# EAGLE schematic minime_2.1.1-a (EAGLE 7.5.0)
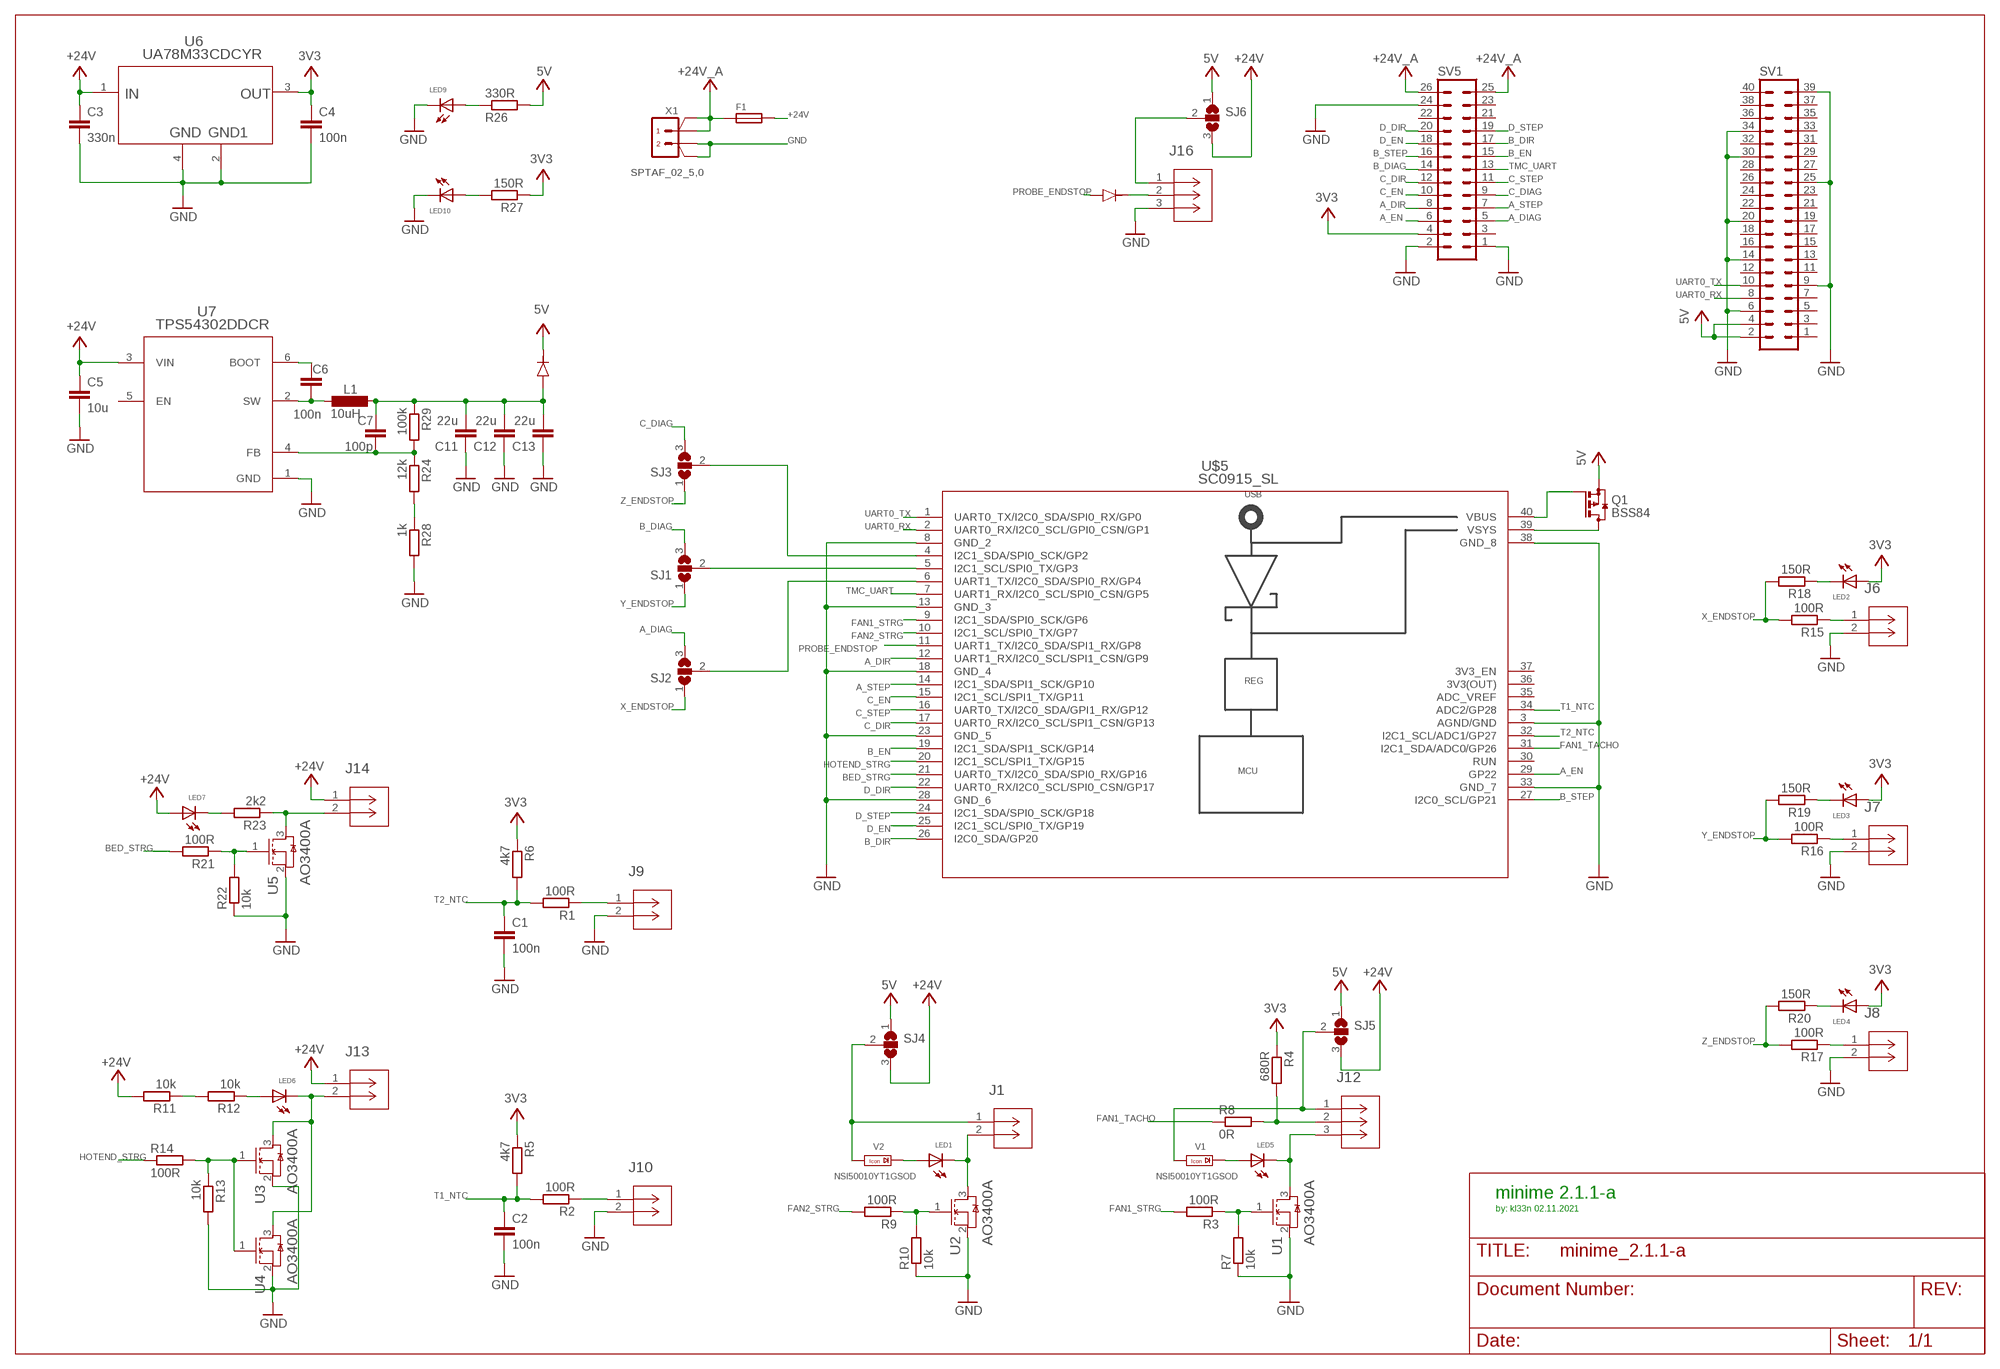
[diagram p0: schematic, sheet 1]

## Parts
C1  100n  C-EUC0603  [C0603]
C2  100n  C-EUC0603  [C0603]
C3  330n  C-EUC0603  [C0603]
C4  100n  C-EUC0603  [C0603]
C5  10u  C-EUC0603  [C0603]
C6  100n  C-EUC0603  [C0603]
C7  100p  C-EUC0603  [C0603]
C11  22u  C-EUC1210K  [C1210K]
C12  22u  C-EUC1210K  [C1210K]
C13  22u  C-EUC1210K  [C1210K]
CR1  SS54  SS14-E3/5AT  [DIODE_DO214AC]
CR2  SS14  SS14-E3/5AT  [DIODE_DO214AC]
F1  FUSE/SERIE154  [FUSE/NANO-OMNI]
J1  B2B-XH-A(LF)(SN)  [CONN_B2B-XH-A(LF)(SN)_JST]
J6  B2B-XH-A(LF)(SN)  [CONN_B2B-XH-A(LF)(SN)_JST]
J7  B2B-XH-A(LF)(SN)  [CONN_B2B-XH-A(LF)(SN)_JST]
J8  B2B-XH-A(LF)(SN)  [CONN_B2B-XH-A(LF)(SN)_JST]
J9  B2B-XH-A(LF)(SN)  [CONN_B2B-XH-A(LF)(SN)_JST]
J10  B2B-XH-A(LF)(SN)  [CONN_B2B-XH-A(LF)(SN)_JST]
J12  B3B-XH-A(LF)(SN)  [CONN_B3B-XH-A_JST]
J13  B2B-XH-A(LF)(SN)  [CONN_B2B-XH-A(LF)(SN)_JST]
J14  B2B-XH-A(LF)(SN)  [CONN_B2B-XH-A(LF)(SN)_JST]
J16  B3B-XH-A(LF)(SN)  [CONN_B3B-XH-A_JST]
L1  10uH  L-EUWE-TPC  [POWER-CHOKE_WE-TPC]
LED1  LEDCHIP-LED0603  [CHIP-LED0603]
LED2  LEDCHIP-LED0603  [CHIP-LED0603]
LED3  LEDCHIP-LED0603  [CHIP-LED0603]
LED4  LEDCHIP-LED0603  [CHIP-LED0603]
LED5  LEDCHIP-LED0603  [CHIP-LED0603]
LED6  LEDCHIP-LED0603  [CHIP-LED0603]
LED7  LEDCHIP-LED0603  [CHIP-LED0603]
LED9  LEDCHIP-LED0603  [CHIP-LED0603]
LED10  LEDCHIP-LED0603  [CHIP-LED0603]
Q1  BSS84  [SOT23]
R1  100R  R-EU_R0603  [R0603]
R2  100R  R-EU_R0603  [R0603]
R3  100R  R-EU_R0603  [R0603]
R4  680R  R-EU_R0603  [R0603]
R5  4k7  R-EU_R0603  [R0603]
R6  4k7  R-EU_R0603  [R0603]
R7  10k  R-EU_R0603  [R0603]
R8  0R  R-EU_R0603  [R0603]
R9  100R  R-EU_R0603  [R0603]
R10  10k  R-EU_R0603  [R0603]
R11  10k  R-EU_R0603  [R0603]
R12  10k  R-EU_R0603  [R0603]
R13  10k  R-EU_R0603  [R0603]
R14  100R  R-EU_R0603  [R0603]
R15  100R  R-EU_R0603  [R0603]
R16  100R  R-EU_R0603  [R0603]
R17  100R  R-EU_R0603  [R0603]
R18  150R  R-EU_R0603  [R0603]
R19  150R  R-EU_R0603  [R0603]
R20  150R  R-EU_R0603  [R0603]
R21  100R  R-EU_R0603  [R0603]
R22  10k  R-EU_R0603  [R0603]
R23  2k2  R-EU_R0603  [R0603]
R24  12k  R-EU_R0603  [R0603]
R26  330R  R-EU_R0603  [R0603]
R27  150R  R-EU_R0603  [R0603]
R28  1k  R-EU_R0603  [R0603]
R29  100k  R-EU_R0603  [R0603]
SJ1  SJ2W  [SJ_2]
SJ2  SJ2W  [SJ_2]
SJ3  SJ2W  [SJ_2]
SJ4  SJ2W  [SJ_2]
SJ5  SJ2W  [SJ_2]
SJ6  SJ2W  [SJ_2]
SV1  MA20-2  [MA20-2]
SV5  MA13-2  [MA13-2]
U1  AO3400A  [SOT-23-3L_AOS]
U2  AO3400A  [SOT-23-3L_AOS]
U3  AO3400A  [SOT-23-3L_AOS]
U4  AO3400A  [SOT-23-3L_AOS]
U5  AO3400A  [SOT-23-3L_AOS]
U6  UA78M33CDCYR  [DCY0004A_N]
U7  TPS54302DDCR  [DDC0006A_N]
U$5  SC0915_SL  [STIFTLEISTE]
V1  NSI50010YT1GSOD  [SOD123]
V2  NSI50010YT1GSOD  [SOD123]
X1  SPTAF_02_5,0  [5-2]

## Nets
3V3: C4.1 LED2.A LED3.A LED4.A R4.1 R5.1 R6.1 R27.1 SV5.4 U6.3(OUTPUT)
5V: CR1.1 Q1.2(S) R26.2 SJ4.1 SJ5.1 SJ6.1 SV1.2 SV1.4
+24V: C3.1 C5.1 F1.2 J13.1 J14.1 LED7.A R11.2 SJ4.3 SJ5.3 SJ6.3 U6.1(INPUT) U7.3(VIN)
+24V_A: F1.1 SV5.25 SV5.26 X1.1 X1.1A
A_DIAG: SJ2.3 SV5.5
A_DIAG_X_ENDSTOP: SJ2.2 U$5.6(UART1_TX/I2C0_SDA/SPI0_RX/GP4)
A_DIR: SV5.8 U$5.12(UART1_RX/I2C0_SCL/SPI1_CSN/GP9)
A_EN: SV5.6 U$5.29(GP22)
A_STEP: SV5.7 U$5.14(I2C1_SDA/SPI1_SCK/GP10)
B_DIAG: SJ1.3 SV5.14
B_DIAG_Y_ENDSTOP: SJ1.2 U$5.5(I2C1_SCL/SPI0_TX/GP3)
B_DIR: SV5.17 U$5.26(I2C0_SDA/GP20)
B_EN: SV5.15 U$5.19(I2C1_SDA/SPI1_SCK/GP14)
B_STEP: SV5.16 U$5.27(I2C0_SCL/GP21)
BED_STRG: R21.2 U$5.21(UART0_TX/I2C0_SDA/SPI0_RX/GP16)
C_DIAG: SJ3.3 SV5.9
C_DIAG_Z_ENDSTOP: SJ3.2 U$5.4(I2C1_SDA/SPI0_SCK/GP2)
C_DIR: SV5.12 U$5.17(UART0_RX/I2C0_SCL/SPI1_CSN/GP13)
C_EN: SV5.10 U$5.15(I2C1_SCL/SPI1_TX/GP11)
C_STEP: SV5.11 U$5.16(UART0_TX/I2C0_SDA/GPI1_RX/GP12)
D_DIR: SV5.20 U$5.22(UART0_RX/I2C0_SCL/SPI0_CSN/GP17)
D_EN: SV5.18 U$5.25(I2C1_SCL/SPI0_TX/GP19)
D_STEP: SV5.19 U$5.24(I2C1_SDA/SPI0_SCK/GP18)
FAN1_STRG: R3.2 U$5.9(I2C1_SDA/SPI0_SCK/GP6)
FAN1_TACHO: R8.1 U$5.31(I2C1_SDA/ADC0/GP26)
FAN2_STRG: R9.2 U$5.10(I2C1_SCL/SPI0_TX/GP7)
GND: C1.2 C2.2 C3.2 C4.2 C5.2 C11.1 C12.1 C13.1 J6.2 J7.2 J8.2 J9.2 J10.2 J16.3 LED9.C LED10.C R7.1 R10.1 R13.2 R22.1 R28.2 SV1.6 SV1.9 SV1.14 SV1.20 SV1.25 SV1.30 SV1.34 SV1.39 SV5.1 SV5.2 SV5.24 U1.2(S) U2.2(S) U3.2(S) U4.2(S) U5.2(S) U6.2(COMMON_2) U6.4(COMMON) U7.1(GND) U$5.3(AGND/GND) U$5.8(GND_2) U$5.13(GND_3) U$5.18(GND_4) U$5.23(GND_5) U$5.28(GND_6) U$5.33(GND_7) U$5.38(GND_8) X1.2 X1.2A
HOTEND_STRG: R14.1 U$5.20(I2C1_SCL/SPI1_TX/GP15)
N$1: LED6.A R12.1
N$2: R11.1 R12.2
N$3: R21.1 R22.2 U5.1(G)
N$4: R13.1 R14.2 U3.1(G) U4.1(G)
N$5: J16.1 SJ6.2
N$6: LED5.A V1.C(K)
N$7: R9.1 R10.2 U2.1(G)
N$9: LED1.A V2.C(K)
N$11: J14.2 R23.1 U5.3(D)
N$12: J1.2 LED1.C U2.3(D)
N$22: J8.1 R17.1
N$23: J7.1 R16.1
N$24: J6.1 R15.1
N$25: J10.1 R2.1
N$26: LED2.C R18.1
N$27: LED3.C R19.1
N$28: J9.1 R1.1
N$29: J12.2 R4.2 R8.2
N$30: LED4.C R20.1
N$31: R3.1 R7.2 U1.1(G)
N$33: LED7.C R23.2
N$35: J12.3 LED5.C U1.3(D)
N$37: J13.2 LED6.C U3.3(D) U4.3(D)
N$40: LED9.A R26.1
N$41: J12.1 SJ5.2 V1.A
N$42: LED10.A R27.2
N$43: J1.1 SJ4.2 V2.A
N$44: CR2.1 J16.2
N$45: R24.2 R28.1
N$47: C6.1 U7.6(BOOT)
N$48: C6.2 L1.2 U7.2(SW)
N$49: C7.2 R24.1 R29.2 U7.4(FB)
N$50: C7.1 C11.2 C12.2 C13.2 CR1.2 L1.1 R29.1
PROBE_ENDSTOP: CR2.2 U$5.11(UART1_TX/I2C0_SDA/SPI1_RX/GP8)
T1_NTC: C2.1 R2.2 R5.2 U$5.34(ADC2/GP28)
T2_NTC: C1.1 R1.2 R6.2 U$5.32(I2C1_SCL/ADC1/GP27)
TMC_UART: SV5.13 U$5.7(UART1_RX/I2C0_SCL/SPI0_CSN/GP5)
UART0_RX: SV1.8 U$5.2(UART0_RX/I2C0_SCL/GPI0_CSN/GP1)
UART0_TX: SV1.10 U$5.1(UART0_TX/I2C0_SDA/SPI0_RX/GP0)
VBUS: Q1.1(G) U$5.40(VBUS)
VSYS: Q1.3(D) U$5.39(VSYS)
X_ENDSTOP: R15.2 R18.2 SJ2.1
Y_ENDSTOP: R16.2 R19.2 SJ1.1
Z_ENDSTOP: R17.2 R20.2 SJ3.1
Unconnected: SV1.1 SV1.3 SV1.5 SV1.7 SV1.11 SV1.12 SV1.13 SV1.15 SV1.16 SV1.17 SV1.18 SV1.19 SV1.21 SV1.22 SV1.23 SV1.24 SV1.26 SV1.27 SV1.28 SV1.29 SV1.31 SV1.32 SV1.33 SV1.35 SV1.36 SV1.37 SV1.38 SV1.40 SV5.3 SV5.21 SV5.22 SV5.23 U7.5(EN) U$5.30(RUN) U$5.36(3V3(OUT))

## Notes on the sheet
- USB
- REG
- MCU
- minime 2.1.1-a
- by: kl33n 02.11.2021

## Power pins joined to a net without a drawn wire
3V3_EN: U$5.37(3V3_EN)
ADC_VREF: U$5.35(ADC_VREF)

## Library data of the parts
C1-C7 C11-C13 = rcl:C-EU: CAPACITOR, European symbol
CR1 CR2 = SS14:SS14-E3/5AT; COPYRIGHT: Copyright (C) 2021 Ultra Librarian. All rights reserved.; MANUFACTURER_PART_NUMBER: SS14-E3/5AT; MFR_NAME: Vishay
F1 = RPG_parts:FUSE/SERIE154: FUSE, with Holder, Serie 154, SMD OMNI-BLOK
J1 J6-J10 J13 J14 = B2B-XH-A:B2B-XH-A(LF)(SN); BUILT_BY: EMA_Cory; COPYRIGHT: Copyright (C) 2018 Accelerated Designs. All rights reserved; MANUFACTURER_PART_NUMBER: B2B-XH-A(LF)(SN); SOURCELIBRARY: JST_2019-12-02; VENDOR: JST
J12 J16 = B3B-XH-A:B3B-XH-A(LF)(SN); BUILT_BY: EMA_Cory; COPYRIGHT: Copyright (C) 2018 Accelerated Designs. All rights reserved; DATASHEET: https://www.jst-mfg.com/product/pdf/eng/eXH.pdf; MANUFACTURER_PART_NUMBER: B3B-XH-A(LF)(SN); SOURCELIBRARY: Add_to_database_2021-02-04; VENDOR: JST
L1 = rcl:L-EU: INDUCTOR, European symbol
LED1-LED7 LED9 LED10 = led:LED: LED OSRAM: - CHIPLED LG R971, LG N971, LY N971, LG Q971, LY Q971, LO R971, LY R971 LH N974, LH R974 LS Q976, LO Q976, LY Q976 LO Q996 - Hyper CHIPLED LW Q18S LB Q993, LB Q99A, LB R99A - SideLED LS A670, LO A670, LY A670, LG A670, LP A670 LB A673, LV A673, LT A673, LW A673 LH A674 LY A675 LS A676, LA A676, LO A676, LY A676, LW A676 LS A679, LY A679, LG A679 - Hyper Micro SIDELED® LS Y876, LA Y876, LO Y876, LY Y876 LT Y87S - SmartLED LW L88C, LW L88S LB L89C, LB L89S, LG L890 LS L89K, LO L89K, LY L89K LS L896, LA L896, LO L896, LY L896 - TOPLED LS T670, LO T670, LY T670, LG T670, LP T670 LSG T670, LSP T670, LSY T670, LOP T670, LYG T670 LG T671, LOG T671, LSG T671 LB T673, LV T673, LT T673, LW T673 LH T674 LS T676, LA T676, LO T676, LY T676, LB T676, LH T676, LSB T676, LW T676 LB T67C, LV T67C, LT T67C, LS T67K, LO T67K, LY T67K, LW E67C LS E67B, LA E67B, LO E67B, LY E67B, LB E67C, LV E67C, LT E67C LW T67C LS T679, LY T679, LG T679 LS T770, LO T770, LY T770, LG T770, LP T770 LB T773, LV T773, LT T773, LW T773 LH T774 LS E675, LA E675, LY E675, LS T675 LS T776, LA T776, LO T776, LY T776, LB T776 LHGB T686 LT T68C, LB T68C - Hyper Mini TOPLED® LB M676 - Mini TOPLED Santana® LG M470 LS M47K, LO M47K, LY M47K Source: http://www.osram.convergy.de LUXEON: - LUMILED® LXK2-PW12-R00, LXK2-PW12-S00, LXK2-PW14-U00, LXK2-PW14-V00 LXK2-PM12-R00, LXK2-PM12-S00, LXK2-PM14-U00 LXK2-PE12-Q00, LXK2-PE12-R00, LXK2-PE12-S00, LXK2-PE14-T00, LXK2-PE14-U00 LXK2-PB12-K00, LXK2-PB12-L00, LXK2-PB12-M00, LXK2-PB14-N00, LXK2-PB14-P00, LXK2-PB14-Q00 LXK2-PR12-L00, LXK2-PR12-M00, LXK2-PR14-Q00, LXK2-PR14-R00 LXK2-PD12-Q00, LXK2-PD12-R00, LXK2-PD12-S00 LXK2-PH12-R00, LXK2-PH12-S00 LXK2-PL12-P00, LXK2-PL12-Q00, LXK2-PL12-R00 Source: www.luxeon.com KINGBRIGHT: KA-3528ASYC Source: www.kingbright.com
Q1 = transistor-small-signal:BSS84: P-CHANNEL MOS FET
R1-R24 R26-R29 = rcl:R-EU_: RESISTOR, European symbol
SJ1-SJ6 = jumper:SJ2W: SMD solder JUMPER
SV1 = con-lstb:MA20-2: PIN HEADER; OC_FARNELL: unknown; OC_NEWARK: unknown
SV5 = con-lstb:MA13-2: PIN HEADER; OC_FARNELL: unknown; OC_NEWARK: unknown
U1-U5 = AO3400A:AO3400A; BUILT_BY: EMA_Molly; COPYRIGHT: Copyright (C) 2018 Accelerated Designs. All rights reserved; MANUFACTURER_PART_NUMBER: AO3400A; SOURCELIBRARY: Alpha_and_Omega_2019-12-17; VENDOR: Alpha and Omega
U6 = UA78M33:UA78M33CDCYR; COPYRIGHT: Copyright (C) 2021 Ultra Librarian. All rights reserved.; MANUFACTURER_PART_NUMBER: UA78M33CDCYR; MFR_NAME: Texas Instruments; REFDES: RefDes; TYPE: TYPE
U7 = TPS54302:TPS54302DDCR; COPYRIGHT: Copyright (C) 2021 Ultra Librarian. All rights reserved.; MANUFACTURER_PART_NUMBER: TPS54302DDCR; MFR_NAME: Texas Instruments; REFDES: RefDes; TYPE: TYPE
U$5 = pi_pico:SC0915_SL
V1 V2 = RPG_parts:NSI50010YT1G; FARNELL: 1794979
X1 = Phoenix_SPTAF-WTB:SPTAF_02_: SPTAF 1/ 2-3,5-EL - Wire-To-Board-Reihenklemme, 3.5 mm, 2 -polig, 24 AWG, 16 AWG, 1.5 mm², Steckanschluss